# EAGLE design PixieChroma (EAGLE 9.5.1)
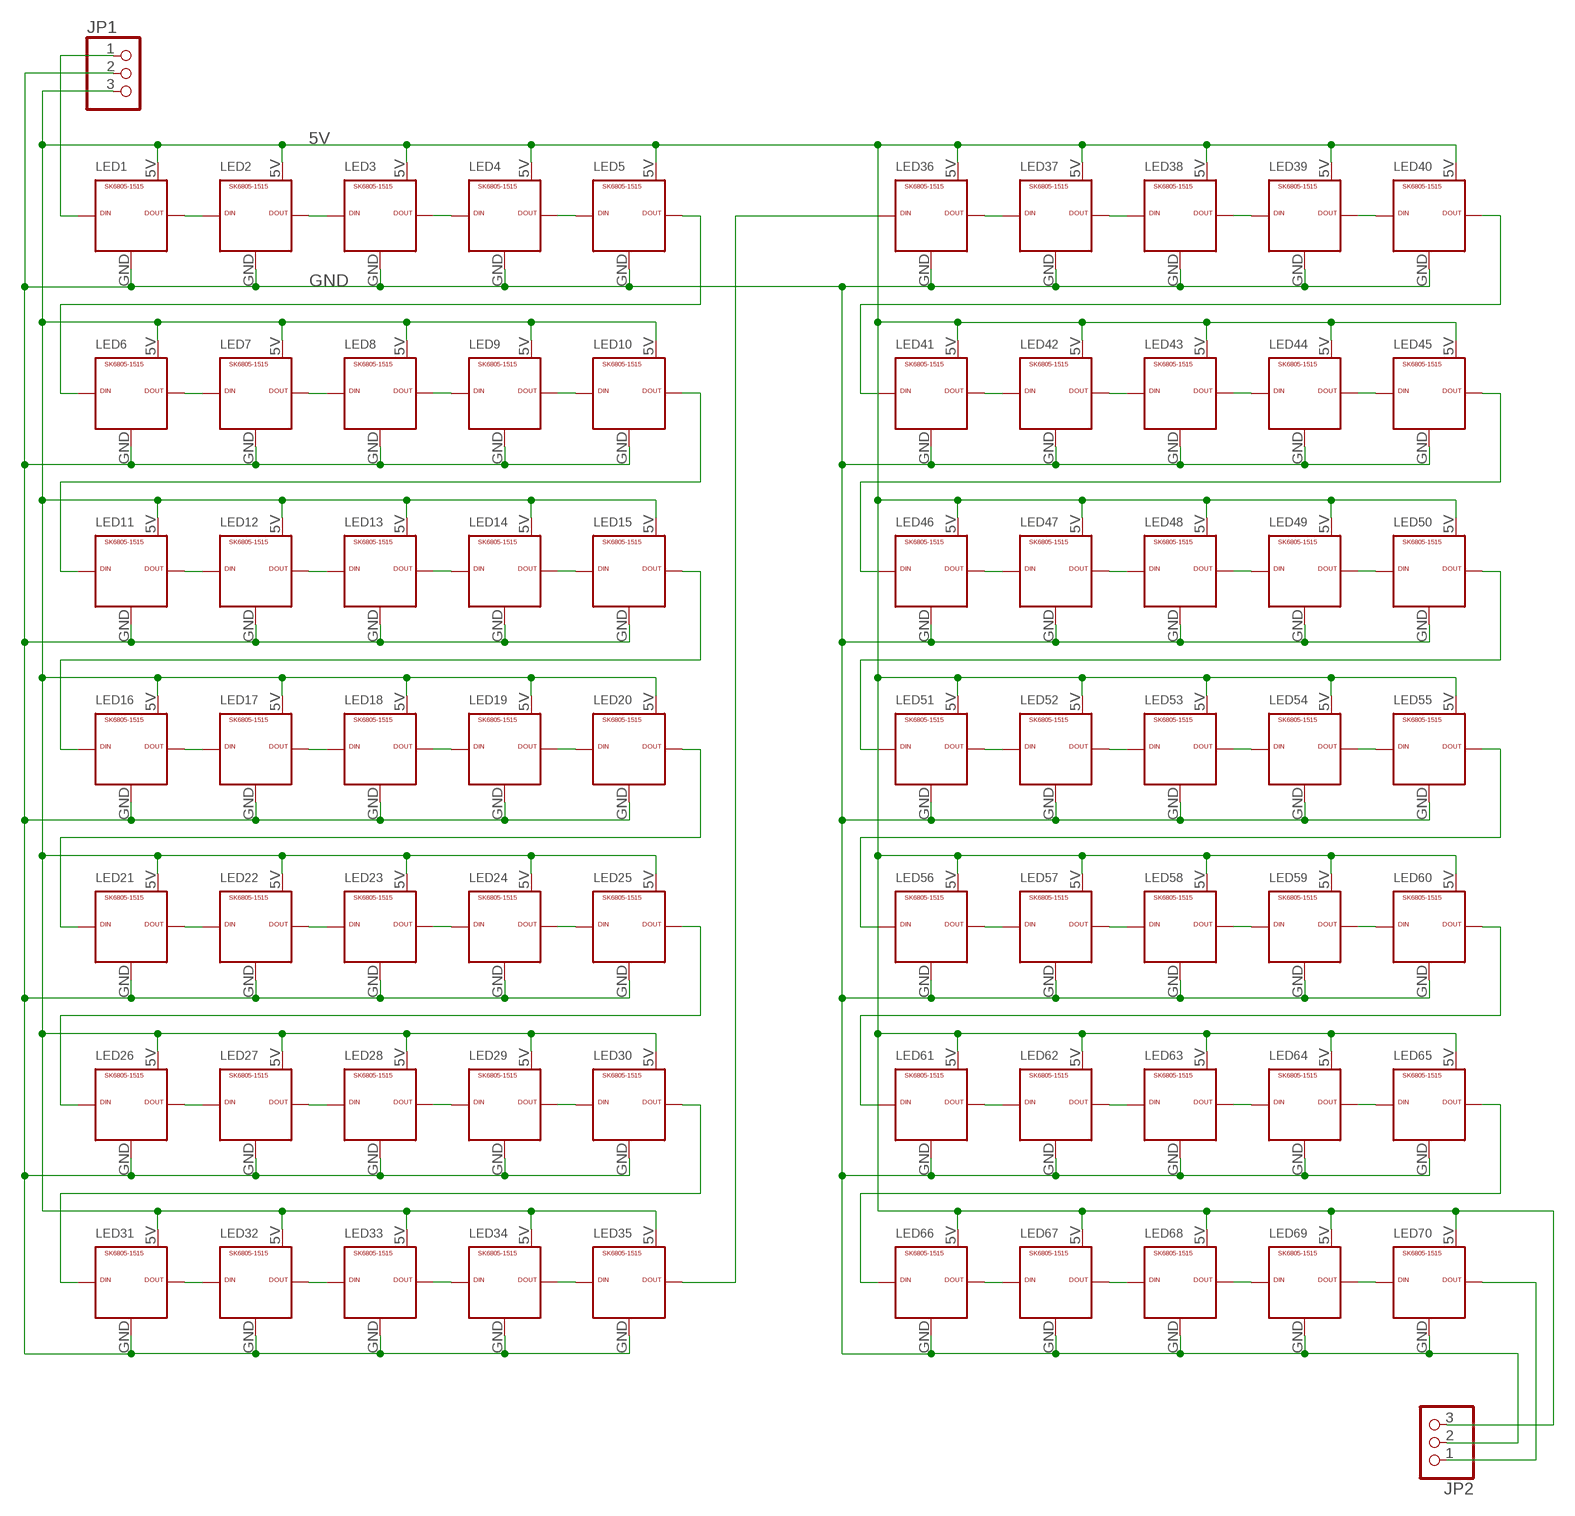
[diagram p0: schematic, sheet 1]

## Parts
JP1  PINHD-1X3  [1X03]
JP2  PINHD-1X3  [1X03]
LED1  SK6805-1515  [1515]
LED2  SK6805-1515  [1515]
LED3  SK6805-1515  [1515]
LED4  SK6805-1515  [1515]
LED5  SK6805-1515  [1515]
LED6  SK6805-1515  [1515]
LED7  SK6805-1515  [1515]
LED8  SK6805-1515  [1515]
LED9  SK6805-1515  [1515]
LED10  SK6805-1515  [1515]
LED11  SK6805-1515  [1515]
LED12  SK6805-1515  [1515]
LED13  SK6805-1515  [1515]
LED14  SK6805-1515  [1515]
LED15  SK6805-1515  [1515]
LED16  SK6805-1515  [1515]
LED17  SK6805-1515  [1515]
LED18  SK6805-1515  [1515]
LED19  SK6805-1515  [1515]
LED20  SK6805-1515  [1515]
LED21  SK6805-1515  [1515]
LED22  SK6805-1515  [1515]
LED23  SK6805-1515  [1515]
LED24  SK6805-1515  [1515]
LED25  SK6805-1515  [1515]
LED26  SK6805-1515  [1515]
LED27  SK6805-1515  [1515]
LED28  SK6805-1515  [1515]
LED29  SK6805-1515  [1515]
LED30  SK6805-1515  [1515]
LED31  SK6805-1515  [1515]
LED32  SK6805-1515  [1515]
LED33  SK6805-1515  [1515]
LED34  SK6805-1515  [1515]
LED35  SK6805-1515  [1515]
LED36  SK6805-1515  [1515]
LED37  SK6805-1515  [1515]
LED38  SK6805-1515  [1515]
LED39  SK6805-1515  [1515]
LED40  SK6805-1515  [1515]
LED41  SK6805-1515  [1515]
LED42  SK6805-1515  [1515]
LED43  SK6805-1515  [1515]
LED44  SK6805-1515  [1515]
LED45  SK6805-1515  [1515]
LED46  SK6805-1515  [1515]
LED47  SK6805-1515  [1515]
LED48  SK6805-1515  [1515]
LED49  SK6805-1515  [1515]
LED50  SK6805-1515  [1515]
LED51  SK6805-1515  [1515]
LED52  SK6805-1515  [1515]
LED53  SK6805-1515  [1515]
LED54  SK6805-1515  [1515]
LED55  SK6805-1515  [1515]
LED56  SK6805-1515  [1515]
LED57  SK6805-1515  [1515]
LED58  SK6805-1515  [1515]
LED59  SK6805-1515  [1515]
LED60  SK6805-1515  [1515]
LED61  SK6805-1515  [1515]
LED62  SK6805-1515  [1515]
LED63  SK6805-1515  [1515]
LED64  SK6805-1515  [1515]
LED65  SK6805-1515  [1515]
LED66  SK6805-1515  [1515]
LED67  SK6805-1515  [1515]
LED68  SK6805-1515  [1515]
LED69  SK6805-1515  [1515]
LED70  SK6805-1515  [1515]

## Nets
5V: JP1.3 JP2.3 LED1.5V LED2.5V LED3.5V LED4.5V LED5.5V LED6.5V LED7.5V LED8.5V LED9.5V LED10.5V LED11.5V LED12.5V LED13.5V LED14.5V LED15.5V LED16.5V LED17.5V LED18.5V LED19.5V LED20.5V LED21.5V LED22.5V LED23.5V LED24.5V LED25.5V LED26.5V LED27.5V LED28.5V LED29.5V LED30.5V LED31.5V LED32.5V LED33.5V LED34.5V LED35.5V LED36.5V LED37.5V LED38.5V LED39.5V LED40.5V LED41.5V LED42.5V LED43.5V LED44.5V LED45.5V LED46.5V LED47.5V LED48.5V LED49.5V LED50.5V LED51.5V LED52.5V LED53.5V LED54.5V LED55.5V LED56.5V LED57.5V LED58.5V LED59.5V LED60.5V LED61.5V LED62.5V LED63.5V LED64.5V LED65.5V LED66.5V LED67.5V LED68.5V LED69.5V LED70.5V
DIN: JP1.1 LED1.DIN
DOUT: JP2.1 LED70.DOUT
GND: JP1.2 JP2.2 LED1.GND LED2.GND LED3.GND LED4.GND LED5.GND LED6.GND LED7.GND LED8.GND LED9.GND LED10.GND LED11.GND LED12.GND LED13.GND LED14.GND LED15.GND LED16.GND LED17.GND LED18.GND LED19.GND LED20.GND LED21.GND LED22.GND LED23.GND LED24.GND LED25.GND LED26.GND LED27.GND LED28.GND LED29.GND LED30.GND LED31.GND LED32.GND LED33.GND LED34.GND LED35.GND LED36.GND LED37.GND LED38.GND LED39.GND LED40.GND LED41.GND LED42.GND LED43.GND LED44.GND LED45.GND LED46.GND LED47.GND LED48.GND LED49.GND LED50.GND LED51.GND LED52.GND LED53.GND LED54.GND LED55.GND LED56.GND LED57.GND LED58.GND LED59.GND LED60.GND LED61.GND LED62.GND LED63.GND LED64.GND LED65.GND LED66.GND LED67.GND LED68.GND LED69.GND LED70.GND
N$1: LED3.DOUT LED4.DIN
N$2: LED2.DOUT LED3.DIN
N$3: LED1.DOUT LED2.DIN
N$4: LED4.DOUT LED5.DIN
N$6: LED18.DOUT LED19.DIN
N$8: LED8.DOUT LED9.DIN
N$9: LED7.DOUT LED8.DIN
N$10: LED6.DOUT LED7.DIN
N$11: LED9.DOUT LED10.DIN
N$12: LED13.DOUT LED14.DIN
N$13: LED5.DOUT LED6.DIN
N$14: LED17.DOUT LED18.DIN
N$15: LED12.DOUT LED13.DIN
N$16: LED11.DOUT LED12.DIN
N$17: LED14.DOUT LED15.DIN
N$18: LED10.DOUT LED11.DIN
N$20: LED16.DOUT LED17.DIN
N$21: LED19.DOUT LED20.DIN
N$22: LED15.DOUT LED16.DIN
N$25: LED23.DOUT LED24.DIN
N$26: LED22.DOUT LED23.DIN
N$27: LED21.DOUT LED22.DIN
N$28: LED24.DOUT LED25.DIN
N$29: LED20.DOUT LED21.DIN
N$32: LED28.DOUT LED29.DIN
N$33: LED27.DOUT LED28.DIN
N$34: LED26.DOUT LED27.DIN
N$35: LED29.DOUT LED30.DIN
N$36: LED25.DOUT LED26.DIN
N$39: LED33.DOUT LED34.DIN
N$40: LED32.DOUT LED33.DIN
N$41: LED31.DOUT LED32.DIN
N$42: LED34.DOUT LED35.DIN
N$43: LED30.DOUT LED31.DIN
N$45: LED38.DOUT LED39.DIN
N$46: LED37.DOUT LED38.DIN
N$47: LED36.DOUT LED37.DIN
N$48: LED39.DOUT LED40.DIN
N$49: LED35.DOUT LED36.DIN
N$51: LED43.DOUT LED44.DIN
N$52: LED42.DOUT LED43.DIN
N$53: LED41.DOUT LED42.DIN
N$54: LED44.DOUT LED45.DIN
N$55: LED40.DOUT LED41.DIN
N$58: LED48.DOUT LED49.DIN
N$59: LED47.DOUT LED48.DIN
N$60: LED46.DOUT LED47.DIN
N$61: LED49.DOUT LED50.DIN
N$62: LED45.DOUT LED46.DIN
N$65: LED53.DOUT LED54.DIN
N$66: LED52.DOUT LED53.DIN
N$67: LED51.DOUT LED52.DIN
N$68: LED54.DOUT LED55.DIN
N$69: LED50.DOUT LED51.DIN
N$72: LED58.DOUT LED59.DIN
N$73: LED57.DOUT LED58.DIN
N$74: LED56.DOUT LED57.DIN
N$75: LED59.DOUT LED60.DIN
N$76: LED55.DOUT LED56.DIN
N$79: LED63.DOUT LED64.DIN
N$80: LED62.DOUT LED63.DIN
N$81: LED61.DOUT LED62.DIN
N$82: LED64.DOUT LED65.DIN
N$83: LED60.DOUT LED61.DIN
N$86: LED68.DOUT LED69.DIN
N$87: LED67.DOUT LED68.DIN
N$88: LED66.DOUT LED67.DIN
N$89: LED69.DOUT LED70.DIN
N$90: LED65.DOUT LED66.DIN

## Library data of the parts
JP1 JP2 = pinhead:PINHD-1X3: PIN HEADER
LED1-LED70 = SK6805-1515:SK6805-1515

## Board
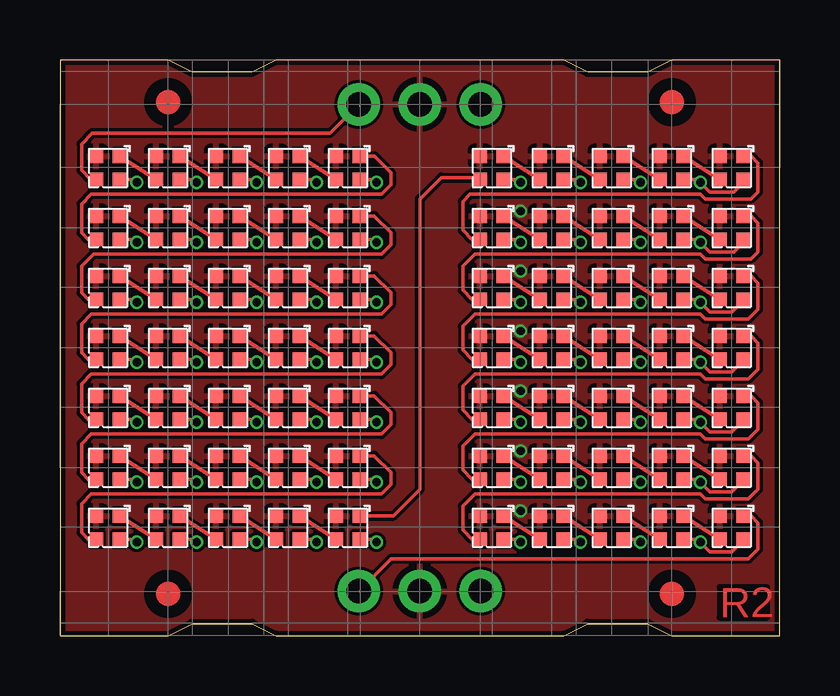
[diagram p1: board, top side]
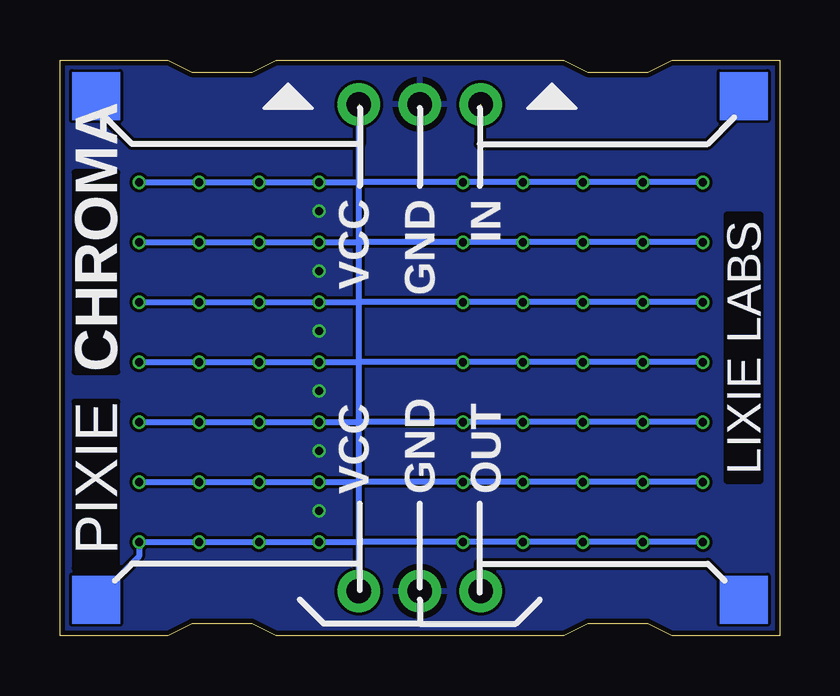
[diagram p2: board, bottom side, seen from below]

Size 30 x 24 mm. Coordinates in mm from the lower left corner, seen from the top.
Outline: 0,0 4.5,0 5.5,0.5 8,0.5 9,0 21,0 22,0.5 24.5,0.5 25.5,0 30,0 30,24 25.5,24 24.5,23.5 22,23.5 21,24 9,24 8,23.5 5.5,23.5 4.5,24 0,24 0,0
Copper layers (1*16): Top 0.035559375mm / dielectric 1.6mm / Bottom 0.035559375mm
Design rules "jlcpcb2layer *": minimum track width 5mil, minimum drill 12mil, track to track 5mil, track to pad 5mil, pad to pad 5mil, via to via 5mil, smd to smd 5mil, copper to edge 8mil, drill to drill 6mil, minimum pad ring 5mil, minimum via ring 3mil, stop-mask expansion 2.5mil, vias tented up to drill 30mil, thermal gap 10mil

### Footprints (pad centres in the part's own frame; a part is rotated, then mirrored left to right if it is on the bottom)
1X03 = drill 1.016 pad 1.778: 1 -2.54,0; 2 0,0; 3 2.54,0
1515 = smd 0.55 x 0.55: 5V 0.48,-0.48; DIN -0.48,-0.48; DOUT 0.48,0.48; GND -0.48,0.48

### Placement (x,y rotation side)
JP1  15,22.15 0 top
JP2  15,1.85 0 top
LED1  2,19.5 0 top
LED2  4.5,19.5 0 top
LED3  7,19.5 0 top
LED4  9.5,19.5 0 top
LED5  12,19.5 0 top
LED6  2,17 0 top
LED7  4.5,17 0 top
LED8  7,17 0 top
LED9  9.5,17 0 top
LED10  12,17 0 top
LED11  2,14.5 0 top
LED12  4.5,14.5 0 top
LED13  7,14.5 0 top
LED14  9.5,14.5 0 top
LED15  12,14.5 0 top
LED16  2,12 0 top
LED17  4.5,12 0 top
LED18  7,12 0 top
LED19  9.5,12 0 top
LED20  12,12 0 top
LED21  2,9.5 0 top
LED22  4.5,9.5 0 top
LED23  7,9.5 0 top
LED24  9.5,9.5 0 top
LED25  12,9.5 0 top
LED26  2,7 0 top
LED27  4.5,7 0 top
LED28  7,7 0 top
LED29  9.5,7 0 top
LED30  12,7 0 top
LED31  2,4.5 0 top
LED32  4.5,4.5 0 top
LED33  7,4.5 0 top
LED34  9.5,4.5 0 top
LED35  12,4.5 0 top
LED36  18,19.5 0 top
LED37  20.5,19.5 0 top
LED38  23,19.5 0 top
LED39  25.5,19.5 0 top
LED40  28,19.5 0 top
LED41  18,17 0 top
LED42  20.5,17 0 top
LED43  23,17 0 top
LED44  25.5,17 0 top
LED45  28,17 0 top
LED46  18,14.5 0 top
LED47  20.5,14.5 0 top
LED48  23,14.5 0 top
LED49  25.5,14.5 0 top
LED50  28,14.5 0 top
LED51  18,12 0 top
LED52  20.5,12 0 top
LED53  23,12 0 top
LED54  25.5,12 0 top
LED55  28,12 0 top
LED56  18,9.5 0 top
LED57  20.5,9.5 0 top
LED58  23,9.5 0 top
LED59  25.5,9.5 0 top
LED60  28,9.5 0 top
LED61  18,7 0 top
LED62  20.5,7 0 top
LED63  23,7 0 top
LED64  25.5,7 0 top
LED65  28,7 0 top
LED66  18,4.5 0 top
LED67  20.5,4.5 0 top
LED68  23,4.5 0 top
LED69  25.5,4.5 0 top
LED70  28,4.5 0 top
U$1  [CIRCLE-1MM-2R]  4.5,22.25 0 top
U$2  [CIRCLE-1MM-2R]  25.5,22.25 0 top
U$3  [CIRCLE-1MM-2R]  4.5,1.75 0 top
U$4  [CIRCLE-1MM-2R]  25.5,1.75 0 top

### Tracks (layer width: path | path; a pad name or v marks a point on that pad's centre or on a via)
5V  (via drill 0.35 pad 0.55)  (1 unrouted)
  Top 0.152: LED1.5V 3.08,19.02 v3.2,18.9 | v5.7,18.9 5.58,19.02 LED2.5V | LED3.5V 8.08,19.02 v8.2,18.9 | v10.7,18.9 10.58,19.02 LED4.5V | v13.2,18.9 13.08,19.02 LED5.5V | LED6.5V 3.08,16.52 v3.2,16.4 | LED7.5V 5.58,16.52 v5.7,16.4 | LED8.5V 8.08,16.52 v8.2,16.4 | LED9.5V 10.58,16.52 v10.7,16.4 | LED10.5V 13.08,16.52 v13.2,16.4 | LED11.5V 3.08,14.02 v3.2,13.9 | LED12.5V 5.58,14.02 v5.7,13.9 | LED13.5V 8.08,14.02 v8.2,13.9 | LED14.5V 10.58,14.02 v10.7,13.9 | LED15.5V 13.08,14.02 v13.2,13.9 | LED16.5V 3.08,11.52 v3.2,11.4 | LED17.5V 5.58,11.52 v5.7,11.4 | LED18.5V 8.08,11.52 v8.2,11.4 | LED19.5V 10.58,11.52 v10.7,11.4 | LED20.5V 13.08,11.52 v13.2,11.4 | LED21.5V 3.08,9.02 v3.2,8.9 | LED22.5V 5.58,9.02 v5.7,8.9 | LED23.5V 8.08,9.02 v8.2,8.9 | LED24.5V 10.58,9.02 v10.7,8.9 | LED25.5V 13.08,9.02 v13.2,8.9 | LED26.5V 3.08,6.52 v3.2,6.4 | LED27.5V 5.58,6.52 v5.7,6.4 | LED28.5V 8.08,6.52 v8.2,6.4 | LED29.5V 10.58,6.52 v10.7,6.4 | LED30.5V 13.08,6.52 v13.2,6.4 | LED31.5V 3.08,4.02 v3.2,3.9 | LED32.5V 5.58,4.02 v5.7,3.9 | LED33.5V 8.08,4.02 v8.2,3.9 | LED34.5V 10.58,4.02 v10.7,3.9 | LED35.5V 13.08,4.02 v13.2,3.9 | LED36.5V 19.08,19.02 v19.2,18.9 | LED37.5V 21.58,19.02 v21.7,18.9 | LED38.5V 24.08,19.02 v24.2,18.9 | LED39.5V 26.58,19.02 v26.7,18.9 27.1,18.5 28.1,18.5 28.48,18.88 LED40.5V | LED41.5V 19.08,16.52 v19.2,16.4 | LED42.5V 21.58,16.52 v21.7,16.4 | LED43.5V 24.08,16.52 v24.2,16.4 | LED44.5V 26.58,16.52 v26.7,16.4 27.1,16 28.1,16 28.48,16.38 LED45.5V | LED46.5V 19.08,14.02 v19.2,13.9 | LED47.5V 21.58,14.02 v21.7,13.9 | LED48.5V 24.08,14.02 v24.2,13.9 | LED49.5V 26.58,14.02 v26.7,13.9 27.1,13.5 28,13.5 28.48,13.98 LED50.5V | LED51.5V 19.08,11.52 v19.2,11.4
  Top 0.152: LED52.5V 21.58,11.52 v21.7,11.4 | LED53.5V 24.08,11.52 v24.2,11.4 | LED54.5V 26.58,11.52 v26.7,11.4 27.1,11 28,11 28.48,11.48 LED55.5V | LED56.5V 19.08,9.02 v19.2,8.9 | LED57.5V 21.58,9.02 v21.7,8.9 | LED58.5V 24.08,9.02 v24.2,8.9 | LED59.5V 26.58,9.02 v26.7,8.9 27.1,8.5 28,8.5 28.48,8.98 LED60.5V | LED61.5V 19.08,6.52 v19.2,6.4 | LED62.5V 21.58,6.52 v21.7,6.4 | LED63.5V 24.08,6.52 v24.2,6.4 | LED64.5V 26.58,6.52 v26.7,6.4 27.1,6 28,6 28.48,6.48 LED65.5V | LED66.5V 19.08,4.02 v19.2,3.9 | LED67.5V 21.58,4.02 v21.7,3.9 | LED68.5V 24.08,4.02 v24.2,3.9 | LED69.5V 26.58,4.02 v26.7,3.9 27.1,3.5 28,3.5 28.48,3.98 LED70.5V
  Bottom 0.254: JP2.3 17.54,3.9 | 17.54,3.9 17.54,6.4 | 17.54,6.4 17.54,8.9 | 17.54,8.9 17.54,11.4 | 17.54,11.4 17.54,13.9 | 17.54,13.9 17.54,16.4 | 17.54,16.4 17.54,18.9 | 17.54,18.9 JP1.3 | 17.54,18.9 v19.2,18.9 v21.7,18.9 v24.2,18.9 v26.7,18.9 | 17.54,16.4 v19.2,16.4 v21.7,16.4 v24.2,16.4 v26.7,16.4 | 17.54,13.9 v19.2,13.9 v21.7,13.9 v24.2,13.9 v26.7,13.9 | 17.54,11.4 v19.2,11.4 v21.7,11.4 v24.2,11.4 v26.7,11.4 | v26.7,8.9 v24.2,8.9 v21.7,8.9 v19.2,8.9 17.54,8.9 | v26.7,6.4 v24.2,6.4 v21.7,6.4 v19.2,6.4 17.54,6.4 | 17.54,3.9 v19.2,3.9 v21.7,3.9 v24.2,3.9 v26.7,3.9 26.7,3.3 27.7,2.3 | 17.54,18.9 v13.2,18.9 v10.7,18.9 v8.2,18.9 v5.7,18.9 v3.2,18.9 | v3.2,16.4 v5.7,16.4 v8.2,16.4 v10.7,16.4 v13.2,16.4 17.54,16.4 | 17.54,13.9 v13.2,13.9 v10.7,13.9 v8.2,13.9 v5.7,13.9 v3.2,13.9 | v3.2,11.4 v5.7,11.4 v8.2,11.4 v10.7,11.4 v13.2,11.4 17.54,11.4 | v3.2,8.9 v5.7,8.9 v8.2,8.9 v10.7,8.9 v13.2,8.9 17.54,8.9 | v3.2,6.4 v5.7,6.4 v8.2,6.4 v10.7,6.4 v13.2,6.4 17.54,6.4 | v3.2,3.9 v5.7,3.9 v8.2,3.9 v10.7,3.9 v13.2,3.9 17.54,3.9 | 17.5,22 17.5,20.5 27,20.5 28.5,22
DIN  (1 unrouted)
  Top 0.152: JP1.1 11.26,20.95 1.35,20.95 0.9,20.5 0.9,19.4 1.28,19.02 LED1.DIN
  Bottom 0.254: 12.5,22 12.5,20.5 3,20.5 1.5,22
DOUT  (1 unrouted)
  Top 0.152: LED70.DOUT 28.82,4.98 29.1,4.7 29.1,3.6 28.7,3.2 13.81,3.2 JP2.1
  Bottom 0.254: 12.5,1.8 12.5,3 3,3 2.3,2.3
GND  (via drill 0.35 pad 0.55)
  other vias: 19.2,17.7 19.2,15.2 19.2,12.7 19.2,10.2 19.2,7.7 19.2,5.2
  pour Top: -0.1,24.1 4.5,24.1 5.5,23.6 8.5,23.6 9.5,24.1 20.5,24.1 21.5,23.6 24.5,23.6 25.5,24.1 30.1,24.1 30.1,-0.1 25.5,-0.1 24.5,0.4 21.5,0.4 20.5,-0.1 9.5,-0.1 8.5,0.4 5.5,0.4 4.5,-0.1 -0.1,-0.1
  pour Bottom: -0.2,24.2 4.5,24.2 5.5,23.7 8.5,23.7 9.5,24.2 20.5,24.2 21.5,23.7 24.57,23.7 25.56,24.2 30.2,24.2 30.1,-0.2 25.5,-0.2 24.5,0.3 21.5,0.3 20.5,-0.2 9.5,-0.2 8.5,0.3 5.5,0.3 4.5,-0.2 -0.2,-0.2
N$1
  Top 0.152: LED3.DOUT LED4.DIN
N$2
  Top 0.152: LED2.DOUT LED3.DIN
N$3
  Top 0.152: LED1.DOUT LED2.DIN
N$4
  Top 0.152: LED4.DOUT LED5.DIN
N$6
  Top 0.152: LED18.DOUT LED19.DIN
N$8
  Top 0.152: LED8.DOUT LED9.DIN
N$9
  Top 0.152: LED7.DOUT LED8.DIN
N$10
  Top 0.152: LED6.DOUT LED7.DIN
N$11
  Top 0.152: LED9.DOUT LED10.DIN
N$12
  Top 0.152: LED13.DOUT LED14.DIN
N$13
  Top 0.152: LED5.DOUT 13.12,19.98 13.8,19.3 13.8,18.8 13.4,18.4 1.3,18.4 0.9,18 0.9,16.8 1.18,16.52 LED6.DIN
N$14
  Top 0.152: LED17.DOUT LED18.DIN
N$15
  Top 0.152: LED12.DOUT LED13.DIN
N$16
  Top 0.152: LED11.DOUT LED12.DIN
N$17
  Top 0.152: LED14.DOUT LED15.DIN
N$18
  Top 0.152: LED10.DOUT 12.5,17.5 13.1,17.5 13.8,16.8 13.8,16.3 13.4,15.9 1.4,15.9 0.9,15.4 0.9,14.3 1.18,14.02 LED11.DIN
N$20
  Top 0.152: LED16.DOUT LED17.DIN
N$21
  Top 0.152: LED19.DOUT LED20.DIN
N$22
  Top 0.152: LED15.DOUT 12.5,15 13.1,15 13.8,14.3 13.8,13.8 13.4,13.4 1.3,13.4 0.9,13 0.9,11.8 1.18,11.52 LED16.DIN
N$25
  Top 0.152: LED23.DOUT LED24.DIN
N$26
  Top 0.152: LED22.DOUT LED23.DIN
N$27
  Top 0.152: LED21.DOUT LED22.DIN
N$28
  Top 0.152: LED24.DOUT LED25.DIN
N$29
  Top 0.152: LED20.DOUT 12.5,12.5 13.1,12.5 13.8,11.8 13.8,11.3 13.4,10.9 1.3,10.9 0.9,10.5 0.9,9.3 1.18,9.02 LED21.DIN
N$32
  Top 0.152: LED28.DOUT LED29.DIN
N$33
  Top 0.152: LED27.DOUT LED28.DIN
N$34
  Top 0.152: LED26.DOUT LED27.DIN
N$35
  Top 0.152: LED29.DOUT LED30.DIN
N$36
  Top 0.152: LED25.DOUT 12.5,10 13.1,10 13.8,9.3 13.8,8.8 13.4,8.4 1.3,8.4 0.9,8 0.9,6.8 1.18,6.52 LED26.DIN
N$39
  Top 0.152: LED33.DOUT LED34.DIN
N$40
  Top 0.152: LED32.DOUT LED33.DIN
N$41
  Top 0.152: LED31.DOUT LED32.DIN
N$42
  Top 0.152: LED34.DOUT LED35.DIN
N$43
  Top 0.152: LED30.DOUT 12.5,7.5 13.1,7.5 13.8,6.8 13.8,6.3 13.4,5.9 1.3,5.9 0.9,5.5 0.9,4.3 1.18,4.02 LED31.DIN
N$45
  Top 0.152: LED38.DOUT LED39.DIN
N$46
  Top 0.152: LED37.DOUT LED38.DIN
N$47
  Top 0.152: LED36.DOUT LED37.DIN
N$48
  Top 0.152: LED39.DOUT LED40.DIN
N$49
  Top 0.152: LED35.DOUT 12.5,5 13.9,5 15,6.1 15,18.2 15.9,19.1 17.44,19.1 LED36.DIN
N$51
  Top 0.152: LED43.DOUT LED44.DIN
N$52
  Top 0.152: LED42.DOUT LED43.DIN
N$53
  Top 0.152: LED41.DOUT LED42.DIN
N$54
  Top 0.152: LED44.DOUT LED45.DIN
N$55
  Top 0.152: LED40.DOUT 28.82,19.98 29.1,19.7 29.1,18.5 28.8,18.2 26.9,18.2 26.7,18.4 17.1,18.4 16.8,18.1 16.8,16.9 17.18,16.52 LED41.DIN
N$58
  Top 0.152: LED48.DOUT LED49.DIN
N$59
  Top 0.152: LED47.DOUT LED48.DIN
N$60
  Top 0.152: LED46.DOUT LED47.DIN
N$61
  Top 0.152: LED49.DOUT LED50.DIN
N$62
  Top 0.152: LED45.DOUT 28.82,17.48 29.1,17.2 29.1,16 28.8,15.7 26.9,15.7 26.7,15.9 17.3,15.9 16.8,15.4 16.8,14.4 17.18,14.02 LED46.DIN
N$65
  Top 0.152: LED53.DOUT LED54.DIN
N$66
  Top 0.152: LED52.DOUT LED53.DIN
N$67
  Top 0.152: LED51.DOUT LED52.DIN
N$68
  Top 0.152: LED54.DOUT LED55.DIN
N$69
  Top 0.152: LED50.DOUT 28.82,14.98 29.1,14.7 29.1,13.6 28.7,13.2 26.9,13.2 26.7,13.4 17.3,13.4 16.8,12.9 16.8,11.9 17.18,11.52 LED51.DIN
N$72
  Top 0.152: LED58.DOUT LED59.DIN
N$73
  Top 0.152: LED57.DOUT LED58.DIN
N$74
  Top 0.152: LED56.DOUT LED57.DIN
N$75
  Top 0.152: LED59.DOUT LED60.DIN
N$76
  Top 0.152: LED55.DOUT 28.82,12.48 29.1,12.2 29.1,11.1 28.7,10.7 26.9,10.7 26.7,10.9 17.3,10.9 16.8,10.4 16.8,9.4 17.18,9.02 LED56.DIN
N$79
  Top 0.152: LED63.DOUT LED64.DIN
N$80
  Top 0.152: LED62.DOUT LED63.DIN
N$81
  Top 0.152: LED61.DOUT LED62.DIN
N$82
  Top 0.152: LED64.DOUT LED65.DIN
N$83
  Top 0.152: LED60.DOUT 28.82,9.98 29.1,9.7 29.1,8.6 28.7,8.2 26.9,8.2 26.7,8.4 17.3,8.4 16.8,7.9 16.8,6.9 17.18,6.52 LED61.DIN
N$86
  Top 0.152: LED68.DOUT LED69.DIN
N$87
  Top 0.152: LED67.DOUT LED68.DIN
N$88
  Top 0.152: LED66.DOUT LED67.DIN
N$89
  Top 0.152: LED69.DOUT LED70.DIN
N$90
  Top 0.152: LED65.DOUT 28.82,7.48 29.1,7.2 29.1,6.1 28.7,5.7 26.9,5.7 26.7,5.9 17.3,5.9 16.8,5.4 16.8,4.4 17.18,4.02 LED66.DIN
(copper drawn outside any net)
  shapes: Bottom area x4

### Text on the board
Top: R2
Bottom: LIXIE LABS | CHROMA | PIXIE
bNames: IN | GND | VCC | LIXIE LABS | CHROMA | PIXIE | OUT | GND | VCC